# EAGLE schematic picaxe_prog_breakout (EAGLE 6.5.0)
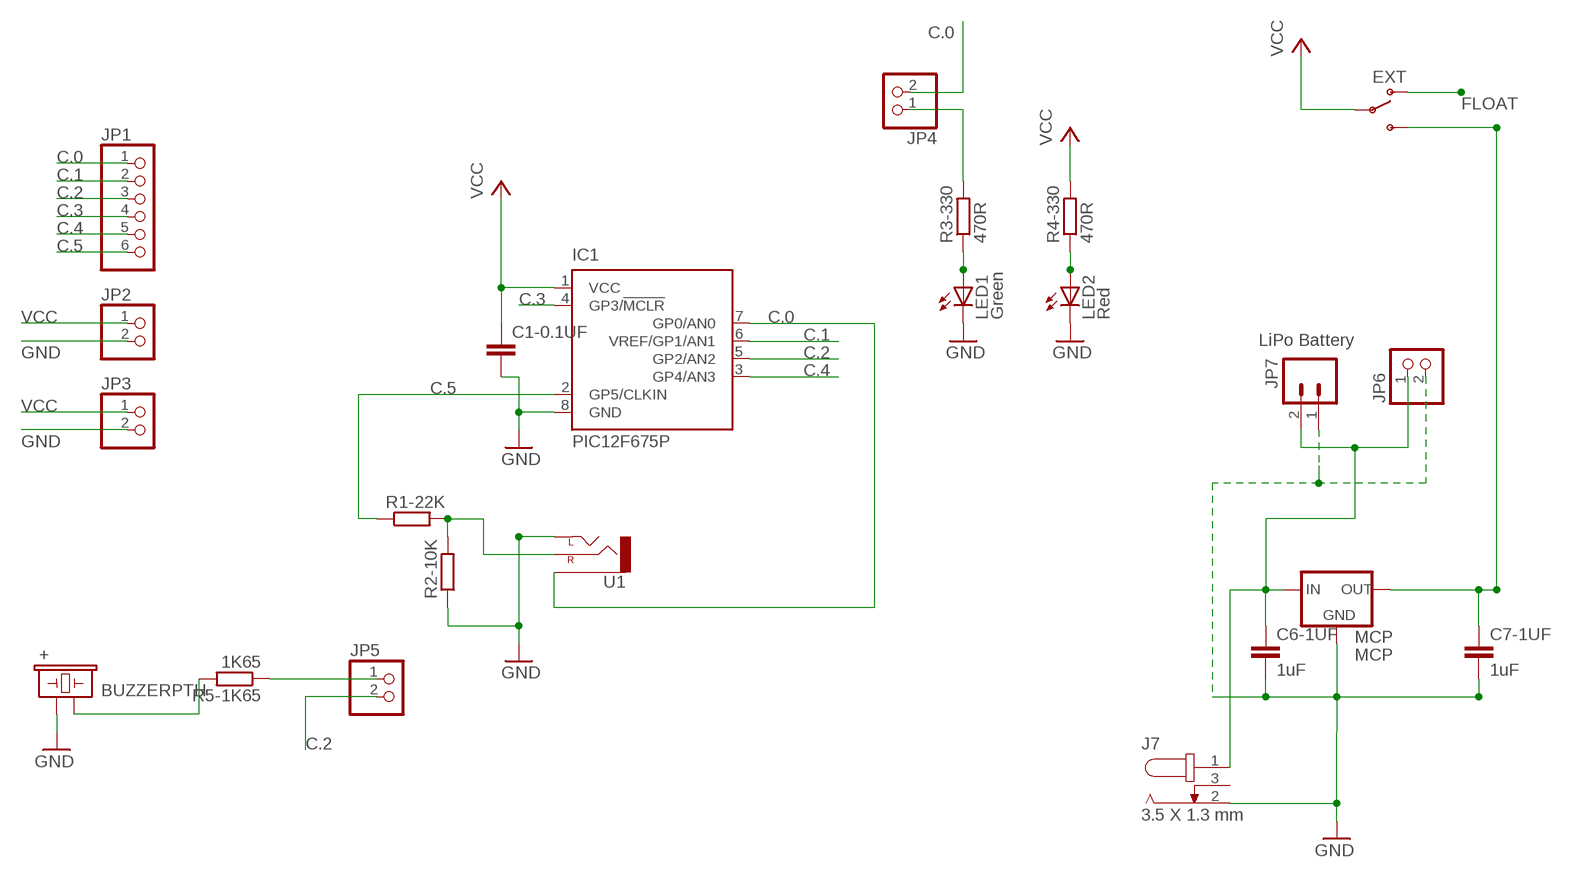
[diagram p0: schematic, sheet 1]

## Parts
+  BUZZERPTH  [BUZZER-12MM]
C1-0.1UF  C-EU025-025X050  [C025-025X050]
C6-1UF  1uF  C-EU050-025X075  [C050-025X075]
C7-1UF  1uF  C-EU050-025X075  [C050-025X075]
IC1  PIC12F675P  [DIL8]
J7  3.5 X 1.3 mm  DC_JACK_3.5X1.3MM  [3.5X1.3MM_DC_JACK]
JP1  PINHD-1X6  [1X06]
JP2  PINHD-1X2  [1X02]
JP3  PINHD-1X2  [1X02]
JP4  PINHD-1X2  [1X02]
JP5  PINHD-1X2  [1X02]
JP6  PINHD-1X2  [1X02]
JP7  LiPo Battery  M02JST-PTH-2  [JST-2-PTH]
LED1  Green  LED3MM  [LED3MM]
LED2  Red  LED3MM  [LED3MM]
MCP  MCP  MCP1700TO-92  [TO92-]
ON  EXT  SWITCH-SPSTPTH  [SWITCH-SPDT]
R1-22K  R-EU_0207/10  [0207/10]
R2-10K  R-EU_0207/10  [0207/10]
R3-330  470R  R-EU_0207/10  [0207/10]
R4-330  470R  R-EU_0207/10  [0207/10]
R5-1K65  1K65  R-EU_0207/10  [0207/10]
U1  AUDIO-JACKPTH  [AUDIO-JACK]

## Nets
C.0: IC1.7(GP0/AN0) JP1.1 JP4.2 U1.SLEEVE
C.1: IC1.6(VREF/GP1/AN1) JP1.2
C.2: IC1.5(GP2/AN2) JP1.3 JP5.2
C.3: IC1.4(GP3/!MCLR) JP1.4
C.4: IC1.3(GP4/AN3) JP1.5
C.5: IC1.2(GP5/CLKIN) JP1.6 R1-22K.1
FLOAT: ON.1(O)
GND [GND]: +.+ C1-0.1UF.2 C6-1UF.2 C7-1UF.2 IC1.8(GND) J7.2 JP2.2 JP3.2 JP6.2 JP7.1 LED1.K(C) LED2.K(C) MCP.3(GND) R2-10K.1 U1.TIP(LEFT)
L-OUT: R1-22K.2 R2-10K.2 U1.RING(RIGHT)
N$1: LED2.A R4-330.1
N$2: +.- R5-1K65.2
N$3: JP4.1 R3-330.2
N$4: LED1.A R3-330.1
N$6: JP5.1 R5-1K65.1
VCC [VCC]: C1-0.1UF.1 IC1.1(VCC) JP2.1 JP3.1 ON.2(P) R4-330.2
VCCEXT [VCC]: C6-1UF.1 J7.1 JP6.1 JP7.2 MCP.2(IN)
VCCREG [VCC]: C7-1UF.1 MCP.1(OUT) ON.3(S)
Unconnected: J7.3

## Library data of the parts
+ = SparkFun:BUZZER: Buzzer 12mm Spark Fun Electronics SKU : Comp-Buzzer
C1-0.1UF C6-1UF C7-1UF = resistor:C-EU: CAPACITOR, European symbol
IC1 = microchip:PIC12F675: 8-Pin FLASH-Based 8-Bit CMOS Microcontroller Precision Internal 4 MHz oscillator factory calibrated to ±1% Low Power Features: Standby Current: - 1 nA @ 2.0V, typical Operating Current: - 8.5µA @ 32 kHz, 2.0V, typical - 100µA @ 1 MHz, 2.0V, typical Watchdog Timer Current: - 300 nA @ 2.0V, typical Timer1 oscillator current: - 4µA @ 32 kHz, 2.0V, typical Analog-to-Digital Converter module: - 10-bit resolution - Programmable 4-channel input - Voltage reference input Source: http://www.microchip.com .. 41190E.pdf; MF: MICROCHIP; MPN: PIC12F675-E/P; OC_FARNELL: 9759018; OC_NEWARK: 92C4340
J7 = MY_CONN:DC_JACK_3.5X1.3MM
JP1 = pinhead:PINHD-1X6: PIN HEADER
JP2-JP6 = pinhead:PINHD-1X2: PIN HEADER
JP7 = SparkFun:M02: Header 2 Standard 2-pin 0.1" header. Use with straight break away headers (SKU : PRT-00116), right angle break away headers (PRT-00553), swiss pins (PRT-00743), machine pins (PRT-00117), and female headers (PRT-00115). Molex polarized connector foot print use with SKU : PRT-08233 with associated crimp pins and housings.
LED1 LED2 = adafruit:LED: LED OSRAM: - CHIPLED LG R971, LG N971, LY N971, LG Q971, LY Q971, LO R971, LY R971 LH N974, LH R974 LS Q976, LO Q976, LY Q976 LO Q996 - Hyper CHIPLED LW Q18S LB Q993, LB Q99A, LB R99A - SideLED LS A670, LO A670, LY A670, LG A670, LP A670 LB A673, LV A673, LT A673, LW A673 LH A674 LY A675 LS A676, LA A676, LO A676, LY A676, LW A676 LS A679, LY A679, LG A679 - Hyper Micro SIDELED® LS Y876, LA Y876, LO Y876, LY Y876 LT Y87S - SmartLED LW L88C, LW L88S LB L89C, LB L89S, LG L890 LS L89K, LO L89K, LY L89K LS L896, LA L896, LO L896, LY L896 - TOPLED LS T670, LO T670, LY T670, LG T670, LP T670 LSG T670, LSP T670, LSY T670, LOP T670, LYG T670 LG T671, LOG T671, LSG T671 LB T673, LV T673, LT T673, LW T673 LH T674 LS T676, LA T676, LO T676, LY T676, LB T676, LH T676, LSB T676, LW T676 LB T67C, LV T67C, LT T67C, LS T67K, LO T67K, LY T67K, LW E67C LS E67B, LA E67B, LO E67B, LY E67B, LB E67C, LV E67C, LT E67C LW T67C LS T679, LY T679, LG T679 LS T770, LO T770, LY T770, LG T770, LP T770 LB T773, LV T773, LT T773, LW T773 LH T774 LS E675, LA E675, LY E675, LS T675 LS T776, LA T776, LO T776, LY T776, LB T776 LHGB T686 LT T68C, LB T68C - Hyper Mini TOPLED® LB M676 - Mini TOPLED Santana® LG M470 LS M47K, LO M47K, LY M47K Source: http://www.osram.convergy.de/
MCP = MY_IC:MCP1700
ON = SparkFun:SWITCH-SPST: SPST Switch Simple slide switch. Spark Fun Electronics SKU : COM-00102
R1-22K R2-10K R3-330 R4-330 R5-1K65 = resistor:R-EU_: RESISTOR, European symbol
U1 = SparkFun-Connectors:AUDIO-JACK: 3.5mm Audio Jack Simple 3.5mm common PCB mount audio jack. SKU: PRT-08032

## Net classes
0 default: width 0.508 mm
1 GND: width 0.889 mm, drill 0.508 mm, clearance 0.254 mm
2 VCC: width 0.889 mm, drill 0.508 mm, clearance 0.254 mm